# Altium schematic sheet Store.SchDoc
size A4
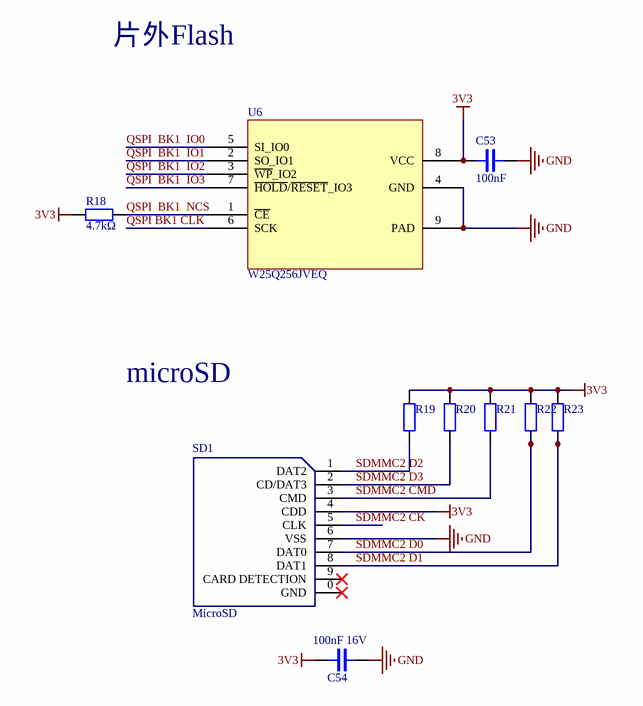
[diagram p0: Store.SchDoc]

## Parts
C53  100nF  [0805]
C54  100nF 16V  [CAP-1812]
R18  4.7kΩ  [0805]
R19  10kΩ  [0805]  (value not drawn)
R20  10kΩ  [0805]  (value not drawn)
R21  10kΩ  [0805]  (value not drawn)
R22  10kΩ  [0805]  (value not drawn)
R23  10kΩ  [0805]  (value not drawn)
SD1  MicroSD  [Micro SD]
U6  W25Q256JVEQ

## Nets
3V3: C53.1 C54.2 R18.1 R19.2 R20.2 R21.2 R22.2 R23.2 SD1.4(CDD) U6.8(VCC)
GND: C53.2 C54.1 SD1.6(VSS) U6.4(GND) U6.9(PAD)
QSPI  BK1  IO0: U6.5(SI_IO0)
QSPI  BK1  IO1: U6.2(SO_IO1)
QSPI  BK1  IO2: U6.3(~{WP}_IO2)
QSPI  BK1  IO3: U6.7(~{HOLD}/~{RESET}_IO3)
QSPI  BK1  NCS: R18.2 U6.1(~{CE})
QSPI BK1 CLK: U6.6(SCK)
SDMMC2 CK: SD1.5(CLK)
SDMMC2 CMD: R21.1 SD1.3(CMD)
SDMMC2 D0: R22.1 SD1.7(DAT0)
SDMMC2 D1: R23.1 SD1.8(DAT1)
SDMMC2 D2: R19.1 SD1.1(DAT2)
SDMMC2 D3: R20.1 SD1.2(CD/DAT3)

Not connected (* = marked no-connect by the designer): SD1 0(GND)* 9(CARD_DETECTION)*

## Notes on the sheet
- 片外Flash
- microSD

## Library data of the parts
C53 C54 = CAP: Capacitor
R18-R23 = RES: Resistor